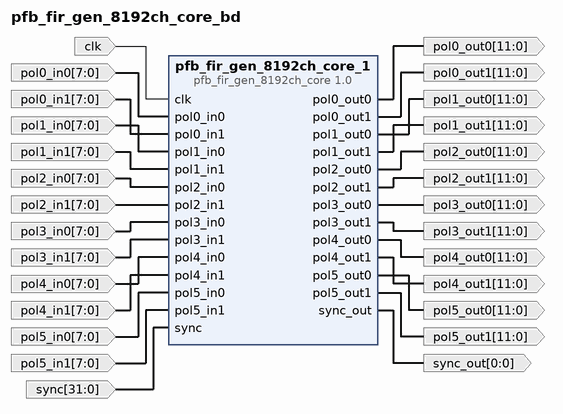
[diagram p0: block diagram of the top level]
# Vivado block design pfb_fir_gen_8192ch_core_bd, xc7k160tffg676-2, Vivado 2016.4
create_bd_design pfb_fir_gen_8192ch_core_bd

create_bd_port -dir I -type clk clk
create_bd_port -dir I -from 7 -to 0 -type data pol0_in0
create_bd_port -dir I -from 7 -to 0 -type data pol0_in1
create_bd_port -dir O -from 11 -to 0 -type data pol0_out0
create_bd_port -dir O -from 11 -to 0 -type data pol0_out1
create_bd_port -dir I -from 7 -to 0 -type data pol1_in0
create_bd_port -dir I -from 7 -to 0 -type data pol1_in1
create_bd_port -dir O -from 11 -to 0 -type data pol1_out0
create_bd_port -dir O -from 11 -to 0 -type data pol1_out1
create_bd_port -dir I -from 7 -to 0 -type data pol2_in0
create_bd_port -dir I -from 7 -to 0 -type data pol2_in1
create_bd_port -dir O -from 11 -to 0 -type data pol2_out0
create_bd_port -dir O -from 11 -to 0 -type data pol2_out1
create_bd_port -dir I -from 7 -to 0 -type data pol3_in0
create_bd_port -dir I -from 7 -to 0 -type data pol3_in1
create_bd_port -dir O -from 11 -to 0 -type data pol3_out0
create_bd_port -dir O -from 11 -to 0 -type data pol3_out1
create_bd_port -dir I -from 7 -to 0 -type data pol4_in0
create_bd_port -dir I -from 7 -to 0 -type data pol4_in1
create_bd_port -dir O -from 11 -to 0 -type data pol4_out0
create_bd_port -dir O -from 11 -to 0 -type data pol4_out1
create_bd_port -dir I -from 7 -to 0 -type data pol5_in0
create_bd_port -dir I -from 7 -to 0 -type data pol5_in1
create_bd_port -dir O -from 11 -to 0 -type data pol5_out0
create_bd_port -dir O -from 11 -to 0 -type data pol5_out1
create_bd_port -dir I -from 31 -to 0 -type data sync
create_bd_port -dir O -from 0 -to 0 -type data sync_out

create_bd_cell -type ip -vlnv User_Company:SysGen:pfb_fir_gen_8192ch_core:1.0 pfb_fir_gen_8192ch_core_1

# ---- connections ----

connect_bd_net [get_bd_ports clk] [get_bd_pins pfb_fir_gen_8192ch_core_1/clk]
connect_bd_net -net pol0_in0_1 [get_bd_ports pol0_in0] [get_bd_pins pfb_fir_gen_8192ch_core_1/pol0_in0]
connect_bd_net -net pol0_in1_1 [get_bd_ports pol0_in1] [get_bd_pins pfb_fir_gen_8192ch_core_1/pol0_in1]
connect_bd_net [get_bd_pins pfb_fir_gen_8192ch_core_1/pol0_out0] [get_bd_ports pol0_out0]
connect_bd_net [get_bd_pins pfb_fir_gen_8192ch_core_1/pol0_out1] [get_bd_ports pol0_out1]
connect_bd_net -net pol1_in0_1 [get_bd_ports pol1_in0] [get_bd_pins pfb_fir_gen_8192ch_core_1/pol1_in0]
connect_bd_net -net pol1_in1_1 [get_bd_ports pol1_in1] [get_bd_pins pfb_fir_gen_8192ch_core_1/pol1_in1]
connect_bd_net [get_bd_pins pfb_fir_gen_8192ch_core_1/pol1_out0] [get_bd_ports pol1_out0]
connect_bd_net [get_bd_pins pfb_fir_gen_8192ch_core_1/pol1_out1] [get_bd_ports pol1_out1]
connect_bd_net -net pol2_in0_1 [get_bd_ports pol2_in0] [get_bd_pins pfb_fir_gen_8192ch_core_1/pol2_in0]
connect_bd_net -net pol2_in1_1 [get_bd_ports pol2_in1] [get_bd_pins pfb_fir_gen_8192ch_core_1/pol2_in1]
connect_bd_net [get_bd_pins pfb_fir_gen_8192ch_core_1/pol2_out0] [get_bd_ports pol2_out0]
connect_bd_net [get_bd_pins pfb_fir_gen_8192ch_core_1/pol2_out1] [get_bd_ports pol2_out1]
connect_bd_net -net pol3_in0_1 [get_bd_ports pol3_in0] [get_bd_pins pfb_fir_gen_8192ch_core_1/pol3_in0]
connect_bd_net -net pol3_in1_1 [get_bd_ports pol3_in1] [get_bd_pins pfb_fir_gen_8192ch_core_1/pol3_in1]
connect_bd_net [get_bd_pins pfb_fir_gen_8192ch_core_1/pol3_out0] [get_bd_ports pol3_out0]
connect_bd_net [get_bd_pins pfb_fir_gen_8192ch_core_1/pol3_out1] [get_bd_ports pol3_out1]
connect_bd_net -net pol4_in0_1 [get_bd_ports pol4_in0] [get_bd_pins pfb_fir_gen_8192ch_core_1/pol4_in0]
connect_bd_net -net pol4_in1_1 [get_bd_ports pol4_in1] [get_bd_pins pfb_fir_gen_8192ch_core_1/pol4_in1]
connect_bd_net [get_bd_pins pfb_fir_gen_8192ch_core_1/pol4_out0] [get_bd_ports pol4_out0]
connect_bd_net [get_bd_pins pfb_fir_gen_8192ch_core_1/pol4_out1] [get_bd_ports pol4_out1]
connect_bd_net -net pol5_in0_1 [get_bd_ports pol5_in0] [get_bd_pins pfb_fir_gen_8192ch_core_1/pol5_in0]
connect_bd_net -net pol5_in1_1 [get_bd_ports pol5_in1] [get_bd_pins pfb_fir_gen_8192ch_core_1/pol5_in1]
connect_bd_net [get_bd_pins pfb_fir_gen_8192ch_core_1/pol5_out0] [get_bd_ports pol5_out0]
connect_bd_net [get_bd_pins pfb_fir_gen_8192ch_core_1/pol5_out1] [get_bd_ports pol5_out1]
connect_bd_net [get_bd_ports sync] [get_bd_pins pfb_fir_gen_8192ch_core_1/sync]
connect_bd_net [get_bd_pins pfb_fir_gen_8192ch_core_1/sync_out] [get_bd_ports sync_out]

validate_bd_design
save_bd_design
